# EAGLE board rev0.1 parts placement (EAGLE 8.6.0)
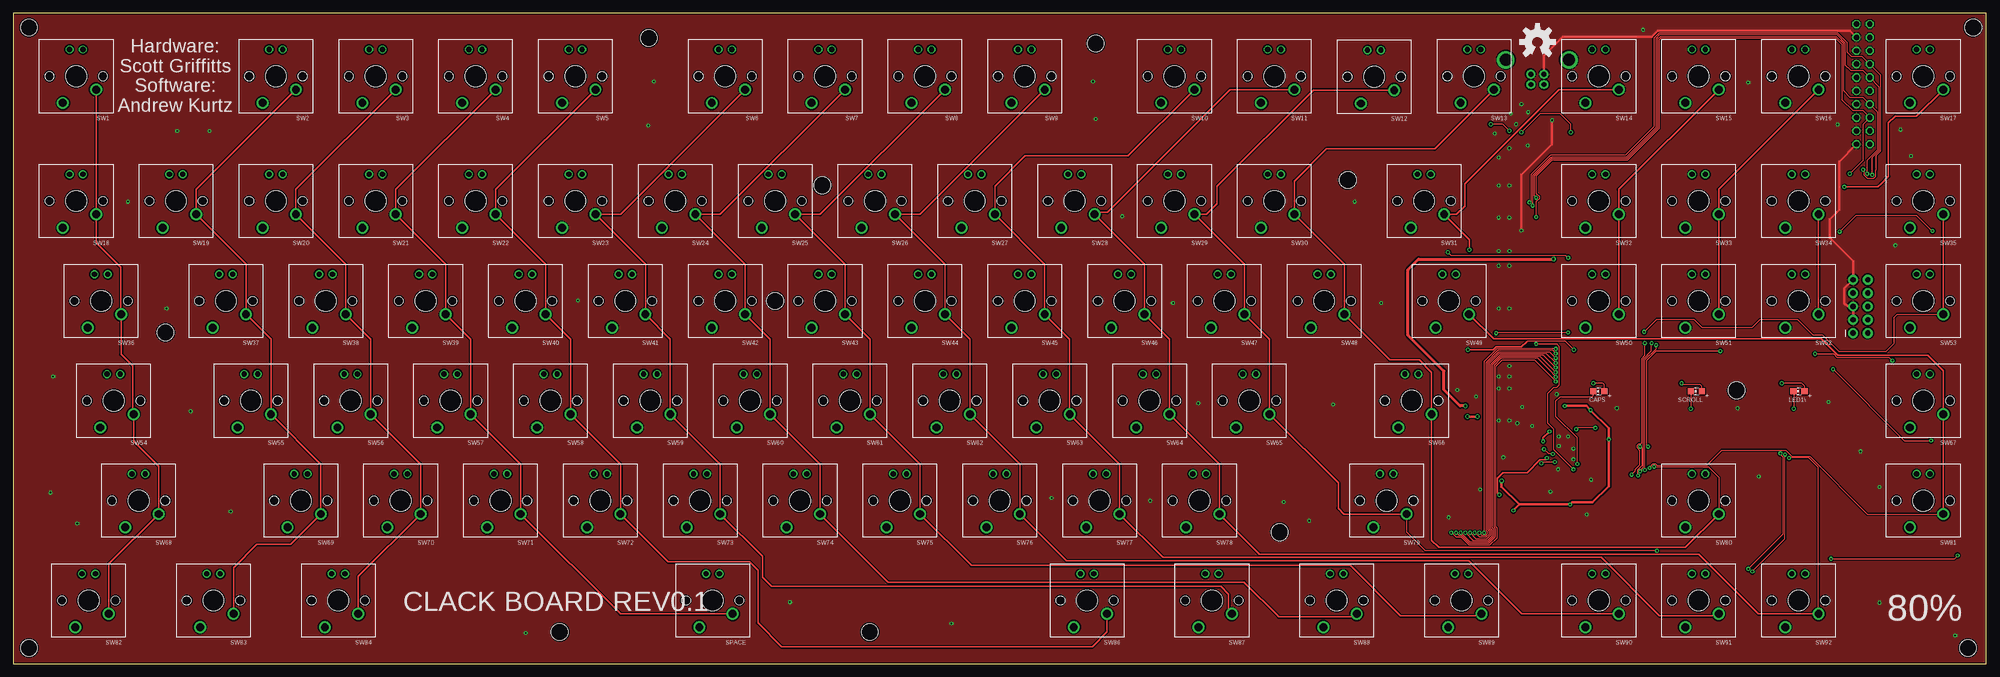
[diagram p6: board, top side]
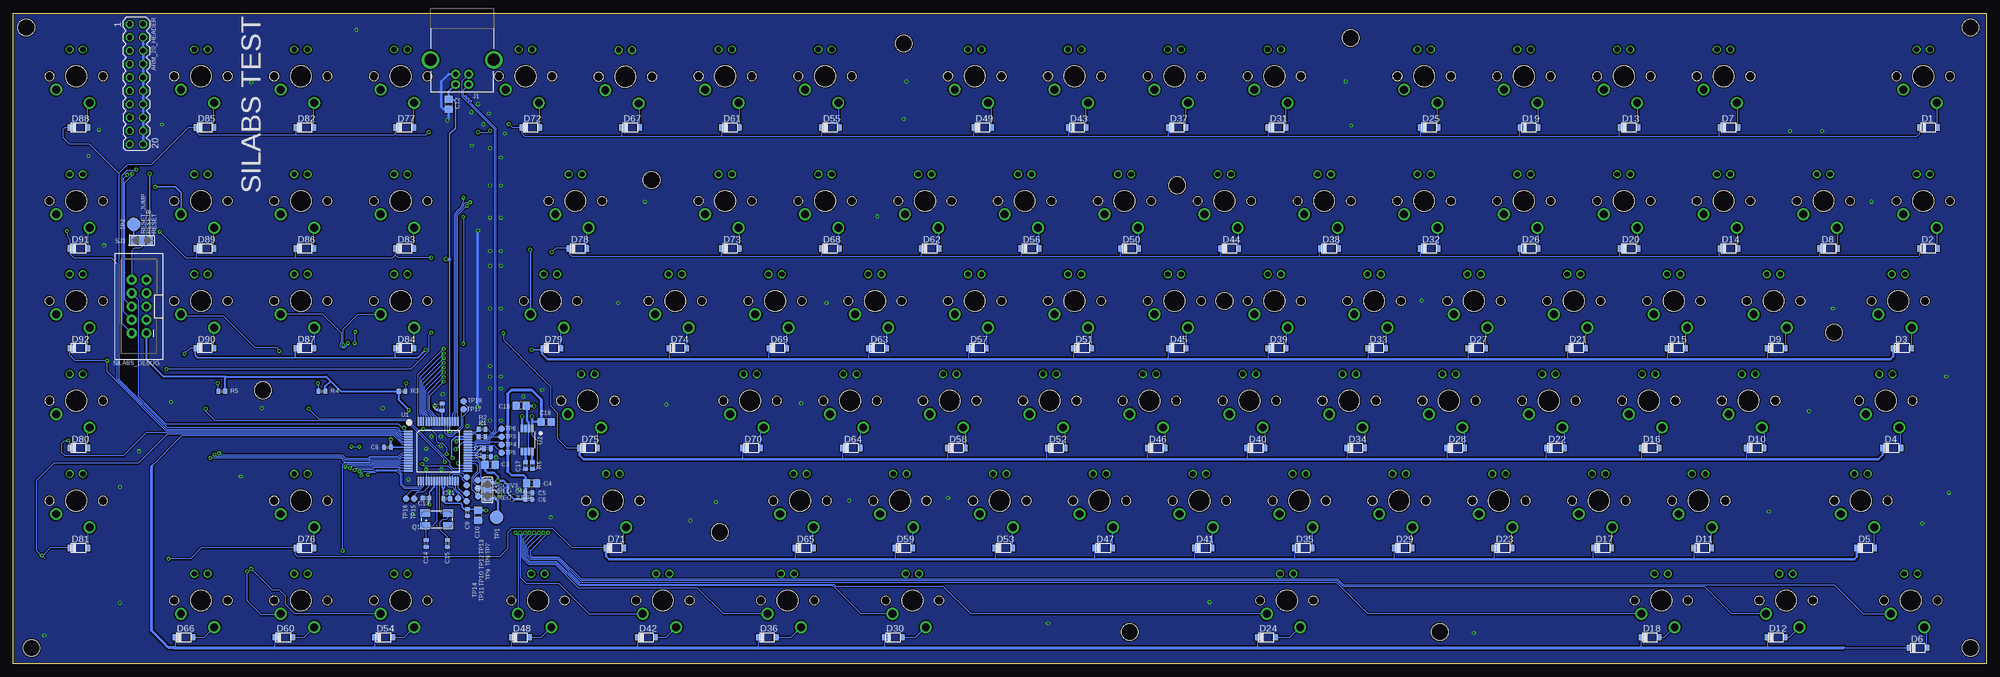
[diagram p7: board, bottom side, seen from below]

Size 375.5 x 123.75 mm. Coordinates in mm from the lower left corner, seen from the top.
Outline: 0,0 375.5,0 375.5,123.75 0,123.75 0,0
Copper layers (1*16): TOP 0.035mm / dielectric 0.33mm / BOTTOM 0.035mm
Design rules "alleybeachdrc4layer *": minimum track width 6mil, minimum drill 0.3mm, track to track 6mil, track to pad 6mil, pad to pad 6mil, via to via 6mil, smd to smd 6mil, copper to edge 10mil, drill to drill 0.3mm, minimum pad ring 10mil, minimum via ring 8mil, stop-mask expansion 5mil, vias tented up to drill 0.4mm, thermal gap 10mil
Holes 3.2 mm at 3,121 373,121 372,3 3,3 145,69 328,52 241,25 206,118 121,119 254,92 29,63 154,91 163,6 104,6

## Footprints (pad centres in the part's own frame; a part is rotated, then mirrored left to right if it is on the bottom)
MA10-2 = drill 1.016 octagon: 1 -11.43,-1.27; 2 -11.43,1.27; 3 -8.89,-1.27; 4 -8.89,1.27; 5 -6.35,-1.27; 6 -6.35,1.27; 7 -3.81,-1.27; 8 -3.81,1.27; 9 -1.27,-1.27; 10 -1.27,1.27; 11 1.27,-1.27; 12 1.27,1.27; 13 3.81,-1.27; 14 3.81,1.27; 15 6.35,-1.27; 16 6.35,1.27; 17 8.89,-1.27; 18 8.89,1.27; 19 11.43,-1.27; 20 11.43,1.27
C0402 = smd 0.7 x 0.9: 1 -0.65,0; 2 0.65,0
C0805 = smd 1.3 x 1.5: 1 -0.95,0; 2 0.95,0
CHIP-LED0805 = smd 1.2 x 1.2: A 0,-1.05; C 0,1.05
SOD323 = smd 0.9 x 1.2: 1 -1.7,0; 2 1.7,0
USB-B-PTH = drill 0.914 pad 1.676: D+ 0,1.25; D- 1.981,1.25; GND 0,-1.25; VBUS 1.981,-1.25 | drill 2.286: S1 -2.718,-6.02; S2 -2.718,6.02
CTS406 = smd 1.9 x 1.4: 1 -2.2,-1.2; 2 2.2,-1.2; 3 2.2,1.2; 4 -2.2,1.2
R0402 = smd 0.7 x 0.9: 1 -0.65,0; 2 0.65,0
2X5-SHROUDED_LOCK = drill 1.016 pad 1.88: 1 -1.397,5.08; 2 1.397,5.08; 3 -1.397,2.54; 4 1.397,2.54; 5 -1.397,0; 6 1.397,0; 7 -1.397,-2.54; 8 1.397,-2.54; 9 -1.397,-5.08; 10 1.397,-5.08
SJ_2 = smd 1.168 x 1.6: 1 -1.524,0; 2 0,0; 3 1.524,0
CHERRY_MX = drill 1.5: 1 -3.81,2.54; 2 2.54,5.08 | drill 1: A -1.27,-5.08; K 1.27,-5.08 | hole 4: 0,0 | hole 1.7: 5.08,0; -5.08,0
B2,54 = smd 2.54 x 2.54: TP 0,0
B1,27 = smd 1.27 x 1.27: TP 0,0
EFM32LG332F256G-E-QFP64 = smd 1.6 x 0.3: 1 -5.65,3.75; 2 -5.65,3.25; 3 -5.65,2.75; 4 -5.65,2.25; 5 -5.65,1.75; 6 -5.65,1.25; 7 -5.65,0.75; 8 -5.65,0.25; 9 -5.65,-0.25; 10 -5.65,-0.75; 11 -5.65,-1.25; 12 -5.65,-1.75; 13 -5.65,-2.25; 14 -5.65,-2.75; 15 -5.65,-3.25; 16 -5.65,-3.75; 33 5.65,-3.75; 34 5.65,-3.25; 35 5.65,-2.75; 36 5.65,-2.25; 37 5.65,-1.75; 38 5.65,-1.25; 39 5.65,-0.75; 40 5.65,-0.25; 41 5.65,0.25; 42 5.65,0.75; 43 5.65,1.25; 44 5.65,1.75; 45 5.65,2.25; 46 5.65,2.75; 47 5.65,3.25; 48 5.65,3.75 | smd 0.3 x 1.6: 17 -3.75,-5.65; 18 -3.25,-5.65; 19 -2.75,-5.65; 20 -2.25,-5.65; 21 -1.75,-5.65; 22 -1.25,-5.65; 23 -0.75,-5.65; 24 -0.25,-5.65; 25 0.25,-5.65; 26 0.75,-5.65; 27 1.25,-5.65; 28 1.75,-5.65; 29 2.25,-5.65; 30 2.75,-5.65; 31 3.25,-5.65; 32 3.75,-5.65; 49 3.75,5.65; 50 3.25,5.65; 51 2.75,5.65; 52 2.25,5.65; 53 1.75,5.65; 54 1.25,5.65; 55 0.75,5.65; 56 0.25,5.65; 57 -0.25,5.65; 58 -0.75,5.65; 59 -1.25,5.65; 60 -1.75,5.65; 61 -2.25,5.65; 62 -2.75,5.65; 63 -3.25,5.65; 64 -3.75,5.65
LP3982IMM-3.3/NOPB = smd 0.45 x 1.45: 1 -0.975,-2.2; 2 -0.325,-2.2; 3 0.325,-2.2; 4 0.975,-2.2; 5 0.975,2.2; 6 0.325,2.2; 7 -0.325,2.2; 8 -0.975,2.2

## Placement (x,y rotation side)
ARM_20_HEADER  [MA10-2]  352.04,110.24 270 bottom
C1  0.1uF  [C0402]  285.24,39.37 0 bottom
C2  10uF  [C0805]  284.73,37.85 0 bottom
C3  1uF  [C0402]  285.24,40.89 0 bottom
C4  10uF  [C0805]  276.86,34.29 0 bottom
C5  1uF  [C0402]  277.37,32.51 0 bottom
C6  0.1uF  [C0402]  277.37,31.24 0 bottom
C7  0.1uF  [C0402]  293.88,48.83 90 bottom
C8  0.1uF  [C0402]  304.29,41.15 180 bottom
C9  0.1uF  [C0402]  289.05,28.7 270 bottom
C10  10uF  [C0805]  287.02,28.19 270 bottom
C11  0.1uF  [C0402]  292.99,31.37 0 bottom
C12  4.7uF  [C0805]  292.61,106.43 270 bottom
C13  0.1uF  [C0402]  296.93,31.5 180 bottom
C14  22pF  [C0402]  296.93,22.86 270 bottom
C15  22pF  [C0402]  292.86,22.86 270 bottom
C16  4.7uF  [C0805]  278.83,49.02 180 bottom
C17  33nF  [C0402]  278,37.66 270 bottom
C18  2.2uF  [C0805]  274.07,45.97 0 bottom
CAPS  [CHIP-LED0805]  301.75,51.82 90 top
D1  1N4148  [SOD323]  11,102 0 bottom
D2  1N4148  [SOD323]  11,79 0 bottom
D3  1N4148  [SOD323]  16,60 0 bottom
D4  1N4148  [SOD323]  18,41 0 bottom
D5  1N4148  [SOD323]  23,22 0 bottom
D6  1N4148  [SOD323]  13,3 0 bottom
D7  1N4148  [SOD323]  49,102 0 bottom
D8  1N4148  [SOD323]  30,79 0 bottom
D9  1N4148  [SOD323]  40,60 0 bottom
D10  1N4148  [SOD323]  44,41 0 bottom
D11  1N4148  [SOD323]  54,22 0 bottom
D12  1N4148  [SOD323]  40,5 0 bottom
D13  1N4148  [SOD323]  68,102 0 bottom
D14  1N4148  [SOD323]  49,79 0 bottom
D15  1N4148  [SOD323]  59,60 0 bottom
D16  1N4148  [SOD323]  64,41 0 bottom
D17  1N4148  [SOD323]  73,22 0 bottom
D18  1N4148  [SOD323]  64,5 0 bottom
D19  1N4148  [SOD323]  87,102 0 bottom
D20  1N4148  [SOD323]  68,79 0 bottom
D21  1N4148  [SOD323]  78,60 0 bottom
D22  1N4148  [SOD323]  82,41 0 bottom
D23  1N4148  [SOD323]  92,22 0 bottom
D24  1N4148  [SOD323]  137,5 0 bottom
D25  1N4148  [SOD323]  106,102 0 bottom
D26  1N4148  [SOD323]  87,79 0 bottom
D27  1N4148  [SOD323]  97,60 0 bottom
D28  1N4148  [SOD323]  101,41 0 bottom
D29  1N4148  [SOD323]  111,22 0 bottom
D30  1N4148  [SOD323]  208,5 0 bottom
D31  1N4148  [SOD323]  135,102 0 bottom
D32  1N4148  [SOD323]  106,79 0 bottom
D33  1N4148  [SOD323]  116,60 0 bottom
D34  1N4148  [SOD323]  120,41 0 bottom
D35  1N4148  [SOD323]  130,22 0 bottom
D36  1N4148  [SOD323]  232,5 0 bottom
D37  1N4148  [SOD323]  154,102 0 bottom
D38  1N4148  [SOD323]  125,79 0 bottom
D39  1N4148  [SOD323]  135,60 0 bottom
D40  1N4148  [SOD323]  139,41 0 bottom
D41  1N4148  [SOD323]  149,22 0 bottom
D42  1N4148  [SOD323]  255,5 0 bottom
D43  1N4148  [SOD323]  173,102 0 bottom
D44  1N4148  [SOD323]  144,79 0 bottom
D45  1N4148  [SOD323]  154,60 0 bottom
D46  1N4148  [SOD323]  158,41 0 bottom
D47  1N4148  [SOD323]  168,22 0 bottom
D48  1N4148  [SOD323]  279,5 0 bottom
D49  1N4148  [SOD323]  191,102 0 bottom
D50  1N4148  [SOD323]  163,79 0 bottom
D51  1N4148  [SOD323]  172,60 0 bottom
D52  1N4148  [SOD323]  177,41 0 bottom
D53  1N4148  [SOD323]  187,22 0 bottom
D54  1N4148  [SOD323]  305,5 0 bottom
D55  1N4148  [SOD323]  220,102 0 bottom
D56  1N4148  [SOD323]  182,79 0 bottom
D57  1N4148  [SOD323]  192,60 0 bottom
D58  1N4148  [SOD323]  196,41 0 bottom
D59  1N4148  [SOD323]  206,22 0 bottom
D60  1N4148  [SOD323]  324,5 0 bottom
D61  1N4148  [SOD323]  239,102 0 bottom
D62  1N4148  [SOD323]  201,79 0 bottom
D63  1N4148  [SOD323]  211,60 0 bottom
D64  1N4148  [SOD323]  216,41 0 bottom
D65  1N4148  [SOD323]  225,22 0 bottom
D66  1N4148  [SOD323]  343,5 0 bottom
D67  1N4148  [SOD323]  258,102 0 bottom
D68  1N4148  [SOD323]  220,79 0 bottom
D69  1N4148  [SOD323]  230,60 0 bottom
D70  1N4148  [SOD323]  235,41 0 bottom
D71  1N4148  [SOD323]  261,22 0 bottom
D72  1N4148  [SOD323]  277,102 0 bottom
D73  1N4148  [SOD323]  239,79 0 bottom
D74  1N4148  [SOD323]  249,60 0 bottom
D75  1N4148  [SOD323]  266,41 0 bottom
D76  1N4148  [SOD323]  320,22 0 bottom
D77  1N4148  [SOD323]  301,102 0 bottom
D78  1N4148  [SOD323]  268,79 0 bottom
D79  1N4148  [SOD323]  273,60 0 bottom
D80  1N4148  [SOD323]  363,41 0 bottom
D81  1N4148  [SOD323]  363,22 0 bottom
D82  1N4148  [SOD323]  320,102 0 bottom
D83  1N4148  [SOD323]  301,79 0 bottom
D84  1N4148  [SOD323]  301,60 0 bottom
D85  1N4148  [SOD323]  339,102 0 bottom
D86  1N4148  [SOD323]  320,79 0 bottom
D87  1N4148  [SOD323]  320,60 0 bottom
D88  1N4148  [SOD323]  363,102 0 bottom
D89  1N4148  [SOD323]  339,79 0 bottom
D90  1N4148  [SOD323]  339,60 0 bottom
D91  1N4148  [SOD323]  363,79 0 bottom
D92  1N4148  [SOD323]  363,60 0 bottom
J1  USB-B  [USB-B-PTH]  290.07,112.14 270 bottom
LED1\  [CHIP-LED0805]  339.85,51.82 90 top
Q1  48MHz  [CTS406]  294.89,27.43 0 bottom
R1  15R  [R0402]  286.26,43.18 0 bottom
R2  15R  [R0402]  286.26,44.58 0 bottom
R3  100R  [R0402]  301.5,51.82 0 bottom
R4  100R  [R0402]  316.74,51.82 180 bottom
R5  100R  [R0402]  335.79,51.82 180 bottom
R6  100K  [R0402]  276.67,37.66 270 bottom
SCROLL  [CHIP-LED0805]  320.29,51.82 90 top
SILABS_DEBUG  [2X5-SHROUDED_LOCK]  351.54,67.94 180 bottom
SJ1  [SJ_2]  285.24,33.02 90 bottom
SJ2  [SJ_2]  351.03,80.52 180 bottom
SPACE  CHERRY_MX  [CHERRY_MX]  133.12,12 180 top
SW1  CHERRY_MX  [CHERRY_MX]  12,111.75 180 top
SW2  CHERRY_MX  [CHERRY_MX]  50,111.75 180 top
SW3  CHERRY_MX  [CHERRY_MX]  69,111.75 180 top
SW4  CHERRY_MX  [CHERRY_MX]  88,111.75 180 top
SW5  CHERRY_MX  [CHERRY_MX]  107,111.75 180 top
SW6  CHERRY_MX  [CHERRY_MX]  135.5,111.75 180 top
SW7  CHERRY_MX  [CHERRY_MX]  154.5,111.75 180 top
SW8  CHERRY_MX  [CHERRY_MX]  173.5,111.75 180 top
SW9  CHERRY_MX  [CHERRY_MX]  192.5,111.75 180 top
SW10  CHERRY_MX  [CHERRY_MX]  221,111.75 180 top
SW11  CHERRY_MX  [CHERRY_MX]  240,111.75 180 top
SW12  CHERRY_MX  [CHERRY_MX]  259,111.65 180 top
SW13  CHERRY_MX  [CHERRY_MX]  278,111.75 180 top
SW14  CHERRY_MX  [CHERRY_MX]  301.75,111.75 180 top
SW15  CHERRY_MX  [CHERRY_MX]  320.75,111.75 180 top
SW16  CHERRY_MX  [CHERRY_MX]  339.75,111.75 180 top
SW17  CHERRY_MX  [CHERRY_MX]  363.5,111.75 180 top
SW18  CHERRY_MX  [CHERRY_MX]  12,88 180 top
SW19  CHERRY_MX  [CHERRY_MX]  31,88 180 top
SW20  CHERRY_MX  [CHERRY_MX]  50,88 180 top
SW21  CHERRY_MX  [CHERRY_MX]  69,88 180 top
SW22  CHERRY_MX  [CHERRY_MX]  88,88 180 top
SW23  CHERRY_MX  [CHERRY_MX]  107,88 180 top
SW24  CHERRY_MX  [CHERRY_MX]  126,88 180 top
SW25  CHERRY_MX  [CHERRY_MX]  145,88 180 top
SW26  CHERRY_MX  [CHERRY_MX]  164,88 180 top
SW27  CHERRY_MX  [CHERRY_MX]  183,88 180 top
SW28  CHERRY_MX  [CHERRY_MX]  202,88 180 top
SW29  CHERRY_MX  [CHERRY_MX]  221,88 180 top
SW30  CHERRY_MX  [CHERRY_MX]  240,88 180 top
SW31  CHERRY_MX  [CHERRY_MX]  268.5,88 180 top
SW32  CHERRY_MX  [CHERRY_MX]  301.75,88 180 top
SW33  CHERRY_MX  [CHERRY_MX]  320.75,88 180 top
SW34  CHERRY_MX  [CHERRY_MX]  339.75,88 180 top
SW35  CHERRY_MX  [CHERRY_MX]  363.5,88 180 top
SW36  CHERRY_MX  [CHERRY_MX]  16.75,69 180 top
SW37  CHERRY_MX  [CHERRY_MX]  40.5,69 180 top
SW38  CHERRY_MX  [CHERRY_MX]  59.5,69 180 top
SW39  CHERRY_MX  [CHERRY_MX]  78.5,69 180 top
SW40  CHERRY_MX  [CHERRY_MX]  97.5,69 180 top
SW41  CHERRY_MX  [CHERRY_MX]  116.5,69 180 top
SW42  CHERRY_MX  [CHERRY_MX]  135.5,69 180 top
SW43  CHERRY_MX  [CHERRY_MX]  154.5,69 180 top
SW44  CHERRY_MX  [CHERRY_MX]  173.5,69 180 top
SW45  CHERRY_MX  [CHERRY_MX]  192.5,69 180 top
SW46  CHERRY_MX  [CHERRY_MX]  211.5,69 180 top
SW47  CHERRY_MX  [CHERRY_MX]  230.5,69 180 top
SW48  CHERRY_MX  [CHERRY_MX]  249.5,69 180 top
SW49  CHERRY_MX  [CHERRY_MX]  273.25,69 180 top
SW50  CHERRY_MX  [CHERRY_MX]  301.75,69 180 top
SW51  CHERRY_MX  [CHERRY_MX]  320.75,69 180 top
SW52  CHERRY_MX  [CHERRY_MX]  339.75,69 180 top
SW53  CHERRY_MX  [CHERRY_MX]  363.5,69 180 top
SW54  CHERRY_MX  [CHERRY_MX]  19.12,50 180 top
SW55  CHERRY_MX  [CHERRY_MX]  45.25,50 180 top
SW56  CHERRY_MX  [CHERRY_MX]  64.25,50 180 top
SW57  CHERRY_MX  [CHERRY_MX]  83.25,50 180 top
SW58  CHERRY_MX  [CHERRY_MX]  102.25,50 180 top
SW59  CHERRY_MX  [CHERRY_MX]  121.25,50 180 top
SW60  CHERRY_MX  [CHERRY_MX]  140.25,50 180 top
SW61  CHERRY_MX  [CHERRY_MX]  159.25,50 180 top
SW62  CHERRY_MX  [CHERRY_MX]  178.25,50 180 top
SW63  CHERRY_MX  [CHERRY_MX]  197.25,50 180 top
SW64  CHERRY_MX  [CHERRY_MX]  216.25,50 180 top
SW65  CHERRY_MX  [CHERRY_MX]  235.25,50 180 top
SW66  CHERRY_MX  [CHERRY_MX]  266.12,50 180 top
SW67  CHERRY_MX  [CHERRY_MX]  363.5,50 180 top
SW68  CHERRY_MX  [CHERRY_MX]  23.88,31 180 top
SW69  CHERRY_MX  [CHERRY_MX]  54.75,31 180 top
SW70  CHERRY_MX  [CHERRY_MX]  73.75,31 180 top
SW71  CHERRY_MX  [CHERRY_MX]  92.75,31 180 top
SW72  CHERRY_MX  [CHERRY_MX]  111.75,31 180 top
SW73  CHERRY_MX  [CHERRY_MX]  130.75,31 180 top
SW74  CHERRY_MX  [CHERRY_MX]  149.75,31 180 top
SW75  CHERRY_MX  [CHERRY_MX]  168.75,31 180 top
SW76  CHERRY_MX  [CHERRY_MX]  187.75,31 180 top
SW77  CHERRY_MX  [CHERRY_MX]  206.75,31 180 top
SW78  CHERRY_MX  [CHERRY_MX]  225.75,31 180 top
SW79  CHERRY_MX  [CHERRY_MX]  261.38,31 180 top
SW80  CHERRY_MX  [CHERRY_MX]  320.75,31 180 top
SW81  CHERRY_MX  [CHERRY_MX]  363.5,31 180 top
SW82  CHERRY_MX  [CHERRY_MX]  14.38,12 180 top
SW83  CHERRY_MX  [CHERRY_MX]  38.12,12 180 top
SW84  CHERRY_MX  [CHERRY_MX]  61.88,12 180 top
SW86  CHERRY_MX  [CHERRY_MX]  204.38,12 180 top
SW87  CHERRY_MX  [CHERRY_MX]  228.12,12 180 top
SW88  CHERRY_MX  [CHERRY_MX]  251.88,12 180 top
SW89  CHERRY_MX  [CHERRY_MX]  275.62,12 180 top
SW90  CHERRY_MX  [CHERRY_MX]  301.75,12 180 top
SW91  CHERRY_MX  [CHERRY_MX]  320.75,12 180 top
SW92  CHERRY_MX  [CHERRY_MX]  339.75,12 180 top
TP1  PTR1B2,54  [B2,54]  283.53,27.81 90 bottom
TP2  PTR1B2,54  [B2,54]  352.55,83.57 90 bottom
TP3  PTR1B1,27  [B1,27]  282.57,43.18 270 bottom
TP4  PTR1B1,27  [B1,27]  282.57,41.66 270 bottom
TP5  PTR1B1,27  [B1,27]  282.57,40.13 270 bottom
TP6  PTR1B1,27  [B1,27]  282.57,44.7 270 bottom
TP7  PTR1B1,27  [B1,27]  287.13,34.88 270 bottom
TP8  PTR1B1,27  [B1,27]  287.15,33.4 270 bottom
TP9  PTR1B1,27  [B1,27]  287.02,31.88 270 bottom
TP10  PTR1B1,27  [B1,27]  289.18,32.38 270 bottom
TP11  PTR1B1,27  [B1,27]  289.18,30.86 270 bottom
TP12  PTR1B1,27  [B1,27]  289.18,33.91 270 bottom
TP13  PTR1B1,27  [B1,27]  289.18,35.43 270 bottom
TP14  PTR1B1,27  [B1,27]  290.83,31.5 270 bottom
TP15  PTR1B1,27  [B1,27]  299.21,31.37 270 bottom
TP16  PTR1B1,27  [B1,27]  300.74,31.37 270 bottom
TP17  PTR1B1,27  [B1,27]  289.81,48.39 270 bottom
TP18  PTR1B1,27  [B1,27]  289.81,49.91 270 bottom
U1  EFM32LG332F256G-E-QFP64  [EFM32LG332F256G-E-QFP64]  294.64,40.39 0 bottom
U2  LP3982IMM-3.3/NOPB  [LP3982IMM-3.3/NOPB]  277.69,42.55 180 bottom
U$15  [OSHW-LOGO-L]  290.07,118.24 0 top

## Tracks (layer width: path | path; a pad name or v marks a point on that pad's centre or on a via)
1_N
  BOTTOM 0.152: U1.47 288.06,43.64 287.97,43.73 287.45,43.73 R1.1
1_P
  BOTTOM 0.152: U1.48 288.08,44.14 287.97,44.03 287.45,44.03 R2.1
C1  (via drill 0.3)
  TOP 0.152: v293.56,53.66 293.56,53.72 289.54,57.75 283.27,57.75 282.04,56.52 282.04,26.17 282.32,25.89 282.32,23.89 280.91,22.48 277.08,22.48 275.55,24 274.64,24 273.75,24.89 v273.69,24.89
  TOP 0.254: SW1.1 SW18.1 15.81,80.08 20.51,75.37 20.51,66.51 SW36.1 20.56,58.81 22.73,56.64 22.73,47.66 SW54.1 22.93,42.34 27.68,37.59 SW68.1 18.18,18.96 SW82.1
  BOTTOM 0.152: SW82.1 18.25,9.4 23.37,9.4 28.88,14.91 122.25,14.91 123.37,16.03 267.36,16.03 271.66,20.32 276.73,20.32 277.17,20.75 277.17,21.41 v273.69,24.89 | U1.57 294.89,46.91 296.26,48.27 296.26,50.96 v293.56,53.66
C2  (via drill 0.3)
  TOP 0.152: v293.56,54.55 293.56,54.61 293.02,55.15 292.98,55.2 290.12,58.05 283.14,58.05 281.74,56.65 281.74,26.04 282.01,25.76 282.01,24.02 280.78,22.79 277.2,22.79 275.68,24.31 275.22,24.31 274.64,24.89 v274.57,24.89
  TOP 0.254: SW83.1 41.94,18.25 46.35,22.67 52.77,22.67 SW69.1 58.56,37.96 SW55.1 49.06,61.71 SW37.1 44.31,75.96 SW19.1 34.81,90.21 SW2.1
  BOTTOM 0.152: SW83.1 48.45,9.46 53.59,14.61 122.38,14.61 123.5,15.72 267.49,15.72 271.74,19.98 271.78,20.02 276.86,20.02 277.47,20.63 277.47,22 v274.57,24.89 | U1.58 295.39,46.98 296.56,48.15 296.56,51.55 v293.56,54.55
C3  (via drill 0.3)
  TOP 0.152: v293.56,55.44 290.64,58.36 283.02,58.36 281.43,56.77 281.43,25.91 281.71,25.64 281.71,24.15 280.65,23.09 277.33,23.09 275.53,24.89 v275.46,24.89
  TOP 0.254: SW3.1 53.81,90.21 SW20.1 63.31,75.96 SW38.1 68.06,61.71 SW56.1 77.56,37.96 SW70.1 65.69,16.59 SW84.1
  BOTTOM 0.152: SW84.1 117.66,9.46 123.62,15.42 267.62,15.42 271.91,19.71 276.99,19.71 277.77,20.5 277.77,22.58 v275.46,24.89 | U1.59 295.89,46.92 296.87,47.89 296.87,52.13 v293.56,55.44
C4  (via drill 0.3)
  TOP 0.152: v293.56,56.33 291.22,58.66 282.89,58.66 281.13,56.9 281.13,25.79 281.4,25.51 281.4,24.27 280.53,23.4 277.91,23.4 276.42,24.89 v276.35,24.89
  TOP 0.254: SW4.1 72.81,90.21 SW21.1 82.31,75.96 SW39.1 87.06,61.71 SW57.1 96.56,37.96 SW71.1 115.56,9.46 SPACE.1
  BOTTOM 0.152: SPACE.1 193.23,9.46 198.5,14.73 218.96,14.73 219.32,15.09 267.72,15.09 272.04,19.41 277.11,19.41 278.08,20.37 278.08,23.16 v276.35,24.89 | U1.60 296.39,46.98 297.17,47.77 297.17,52.71 v293.56,56.33
C5  (via drill 0.3)
  TOP 0.152: v293.56,57.21 291.81,58.97 282.76,58.97 280.82,57.02 280.82,25.66 281.1,25.39 281.1,24.4 280.4,23.7 278.5,23.7 277.31,24.89 v277.24,24.89
  TOP 0.254: SW5.1 91.81,90.21 SW22.1 101.31,75.96 SW40.1 106.06,61.71 SW58.1 115.56,37.96 SW72.1 124.65,19.37 140.14,19.37 141.73,17.78 141.73,7.75 146.24,3.24 205.36,3.24 208.19,6.06 SW86.1
  BOTTOM 0.152: v277.24,24.89 278.38,23.75 278.38,20.25 277.24,19.1 272.16,19.1 267.84,14.78 219.44,14.78 214.12,9.46 SW86.1 | U1.61 296.89,47.05 297.48,47.64 297.48,53.3 v293.56,57.21
C6  (via drill 0.3)
  TOP 0.152: v293.56,58.1 292.39,59.27 282.64,59.27 280.52,57.15 280.52,25.54 280.8,25.26 280.8,24.52 280.27,24 279.08,24 278.2,24.89 v278.13,24.89
  TOP 0.254: SW6.1 115.56,85.46 SW23.1 120.31,75.96 SW41.1 125.06,61.71 SW59.1 134.56,37.96 SW73.1 142.62,20.4 142.62,16.38 144.34,14.67 229.81,14.67 231.27,13.21 231.27,10.13 SW87.1
  BOTTOM 0.152: SW87.1 240.35,9.46 245.36,14.48 267.97,14.48 272.29,18.8 277.36,18.8 278.69,20.12 278.69,24.28 278.71,24.31 v278.13,24.89 | U1.62 297.39,47.12 297.78,47.51 297.78,53.88 v293.56,58.1
C7  (via drill 0.3)
  TOP 0.152: v293.56,58.99 292.98,59.58 282.51,59.58 280.21,57.28 280.21,25.41 280.49,25.13 280.49,24.65 280.15,24.31 279.6,24.31 v279.02,24.89
  TOP 0.254: SW7.1 134.56,85.46 SW24.1 139.31,75.96 SW42.1 144.06,61.71 SW60.1 153.56,37.96 SW74.1 166.53,15.49 234.25,15.49 240.86,8.89 255.12,8.89 SW88.1
  BOTTOM 0.152: v279.02,24.89 279.02,16.38 277.88,15.24 271.65,15.24 265.87,9.46 SW88.1 | U1.63 297.89,47.19 298.08,47.39 298.08,54.47 v293.56,58.99
C8  (via drill 0.3)
  TOP 0.152: v293.56,59.88 282.38,59.88 279.91,57.4 v279.91,24.89
  TOP 0.254: SW8.1 153.56,85.46 SW25.1 158.31,75.96 SW43.1 163.06,61.71 SW61.1 172.56,37.96 SW75.1 182.35,18.67 254.44,18.67 263.97,9.14 279.12,9.14 SW89.1
  BOTTOM 0.152: U1.64 298.39,55.05 v293.56,59.88 | v279.91,24.89 279.44,24.42 SW89.1
C9  (via drill 0.3)
  TOP 0.152: v330.2,18.03 336.88,24.71 336.88,39.23 336.6,39.51 336.6,39.7 v336.3,40.01
  TOP 0.254: 289.37,9.46 287.08,9.46 276.99,19.56 200.46,19.56 SW76.1 191.56,37.96 SW62.1 182.06,61.71 SW44.1 177.31,75.96 SW26.1 172.56,85.46 SW9.1 | 289.37,9.46 | 289.37,9.46 SW90.1
  BOTTOM 0.152: U1.9 301.52,40.14 302.3,39.35 307.68,39.35 307.9,39.14 | 307.9,39.14 307.95,39.09 | SW90.1 321.88,9.46 323.6,11.18 323.6,12.83 324.74,13.97 326.14,13.97 v330.2,18.03 | v336.3,40.01 336.02,39.73 313.44,39.73 | 313.44,39.73 | 313.44,39.73 312.93,39.73 312.25,39.05 307.99,39.05 307.95,39.09 | 307.95,39.09 307.9,39.14 | 307.95,39.09
C10  (via drill 0.3)
  TOP 0.152: v330.96,17.53 337.19,23.75 v337.19,39.75
  TOP 0.254: SW10.1 212.18,96.58 192.59,96.58 186.81,90.8 SW27.1 196.31,75.96 SW45.1 201.06,61.71 SW63.1 210.56,37.96 SW77.1 218.83,20.19 302.2,20.19 313.25,9.14 324.24,9.14 SW91.1
  BOTTOM 0.152: U1.10 301.59,39.64 302.17,39.05 307.56,39.05 307.79,38.81 | 307.79,38.81 307.86,38.75 | SW91.1 324.75,9.27 328.3,9.27 330.96,11.94 v330.96,17.53 | v337.19,39.75 336.86,39.42 313.31,39.42 | 313.31,39.42 | 313.31,39.42 313.06,39.42 312.38,38.75 307.86,38.75 | 307.86,38.75 307.82,38.78 | 307.82,38.78 | 307.82,38.78 307.79,38.81
C11  (via drill 0.3)
  TOP 0.152: SW92.1 343.56,37.31 341.76,39.12 v337.95,39.12
  TOP 0.254: SW11.1 231.57,109.21 208.22,85.85 206.2,85.85 SW28.1 215.31,75.96 SW46.1 220.06,61.71 SW64.1 229.56,37.96 SW78.1 237.19,20.83 320.74,20.83 332.11,9.46 SW92.1
  BOTTOM 0.152: U1.11 301.65,39.14 302.05,38.75 307.43,38.75 307.73,38.44 312.51,38.44 313.18,39.12 v337.95,39.12
C12  (via drill 0.3)
  TOP 0.152: v312.8,21.46 268.73,21.46 265.19,25.01 SW79.1
  TOP 0.254: SW12.1 247.41,109.11 229.11,90.81 229.11,87.44 227.13,85.46 SW29.1 234.31,75.96 SW47.1 239.06,61.71 SW65.1 252.16,34.36 252.16,29.59 253.29,28.46 SW79.1
  BOTTOM 0.152: U1.12 301.72,38.64 301.92,38.44 307.3,38.44 307.62,38.12 312.52,38.12 312.93,37.72 312.93,21.59 v312.8,21.46
C13  (via drill 0.3)
  TOP 0.152: v312.29,37.47 322.58,37.47 324.56,35.48 SW80.1
  TOP 0.254: SW13.1 270.52,97.92 249.94,97.92 243.81,91.79 SW30.1 253.31,75.96 SW48.1 261.99,57.78 267.59,57.78 269.94,55.44 SW66.1 269.94,23.5 271.34,22.1 318.2,22.1 SW80.1
  BOTTOM 0.152: U1.13 307.18,38.14 307.49,37.82 311.94,37.82 v312.29,37.47
C14  (via drill 0.3, 0.43)
  TOP 0.152: v311.4,37.21 311.71,37.52 311.71,37.71 312.05,38.05 312.53,38.05 312.81,37.77 322.33,37.77 325.14,40.59 337.3,40.59 338.46,39.42 341.88,39.42 352.84,28.46 SW81.1
  TOP 0.254: SW14.1 294.19,109.21 276.23,91.25 276.23,87.06 274.63,85.46 SW31.1 277.11,80.66 v277.11,78.74 | SW49.1 281.74,61.78 344.11,61.78 347.22,58.67 364.36,58.67 367.31,55.73 SW67.1 SW81.1
  BOTTOM 0.152: U1.14 301.8,37.64 301.99,37.83 307.05,37.83 307.37,37.52 311.1,37.52 v311.4,37.21
  BOTTOM 0.254: v277.11,78.74 277.06,78.69 SW49.1
C15  (via drill 0.3)
  TOP 0.152: v310.51,36.83 310.51,57.78 312.67,59.94 v312.67,60.58
  TOP 0.254: SW15.1 305.56,90.21 SW32.1 SW50.1
  BOTTOM 0.152: U1.15 301.73,37.14 302.12,37.53 306.92,37.53 307.24,37.21 310.13,37.21 v310.51,36.83 | v312.67,60.58 312.67,63.63 309.88,66.42 305.6,66.42 SW50.1
C16  (via drill 0.3)
  TOP 0.152: v309.63,36.58 309.93,36.88 309.93,37.07 310.21,37.35 310.21,57.91 311.79,59.49 v311.79,60.96
  TOP 0.254: SW16.1 324.56,90.21 SW33.1 SW51.1
  BOTTOM 0.152: U1.16 301.66,36.64 302.24,37.22 306.8,37.22 307.11,36.91 309.3,36.91 v309.63,36.58 | v311.79,60.96 312.09,60.65 312.09,60.34 312.43,60 312.92,60 313.26,60.34 313.26,60.82 312.98,61.1 312.98,62.81 316.62,66.46 SW51.1
C17  (via drill 0.3, 0.35)
  TOP 0.152: v324.87,59.44 312.6,59.44 310.82,57.66 310.82,41.6 v311.15,41.27 | v309.63,41.27 309.9,41 309.9,37.68 309.04,36.82 309.04,36.34 309.21,36.17 v309.21,35.78
  TOP 0.254: SW34.1 SW52.1 | 355.5,91.34 355.41,91.25 | 355.5,91.34 356.87,92.71 356.87,102.87 358.14,104.14 362.2,104.14 367.27,109.21 SW17.1 | v348.49,90.68 354.84,90.68 355.5,91.34
  BOTTOM 0.152: U1.17 298.39,33.72 298.58,33.53 300.86,33.53 301.5,34.16 301.5,36.05 302.37,36.92 306.45,36.92 306.77,36.6 308.84,36.6 309.04,36.4 309.04,36.34 309.21,36.17 v309.21,35.78 | SW52.1 343.27,66.17 335.53,66.17 329.56,60.2 325.37,60.2 324.87,59.69 v324.87,59.44 | v311.15,41.27 v309.63,41.27
  BOTTOM 0.254: SW34.1 343.56,89.56 344.68,90.68 v348.49,90.68
C18  (via drill 0.3)
  TOP 0.152: v307.98,35.94 308.74,36.7 308.74,36.94 309.6,37.8 309.6,40.48 309.04,41.03 309.04,41.52 309.38,41.86 309.73,41.86 309.9,42.04 309.9,58.04 310.51,58.65 v310.51,60.96 | v310.39,63.12 312.8,65.53 319.79,65.53 321.31,64.01 330.96,64.01 332.36,65.41 339.6,65.41 342.56,62.45 344.38,62.45 347.49,59.33 356.39,59.33 357.89,60.83 357.89,65.84 358.51,66.46 SW53.1
  TOP 0.254: SW53.1 SW35.1
  BOTTOM 0.152: U1.18 297.89,33.78 298.45,33.22 300.99,33.22 301.8,34.04 301.8,35.92 302.5,36.61 306.32,36.61 306.64,36.3 307.62,36.3 v307.98,35.94 | v310.51,60.96 310.39,61.09 v310.39,63.12
GND  (via drill 0.3)
  TOP 0.508: ARM_20_HEADER.4 349.5,120.4 312.98,120.4 311.84,119.25 294.89,119.25 291.32,115.68 J1.GND | v292.86,103.38 292.86,98.81 287.02,92.96 v287.02,82.42 | ARM_20_HEADER.20 347.47,95.5 347.47,86.36 345.69,84.58 345.69,81.03 350.14,76.58 SILABS_DEBUG.9 348.49,71.37 348.49,68.58 349.12,67.94 SILABS_DEBUG.5 SILABS_DEBUG.3
  BOTTOM 0.508: ARM_20_HEADER.20 ARM_20_HEADER.18 ARM_20_HEADER.16 ARM_20_HEADER.14 ARM_20_HEADER.12 ARM_20_HEADER.10 ARM_20_HEADER.8 ARM_20_HEADER.6 ARM_20_HEADER.4 | J1.GND 292.61,112.14 294,110.74 294,105.92 293.56,105.48 C12.2 292.61,103.63 v292.86,103.38 | v287.02,82.42 287.15,82.3 v287.15,48.83
  other vias: 294,36.96 300.29,34.99 299.4,28.38 293.75,51.24 305.18,48.58 274.83,52.07 273.15,27.83 278.38,50.8 328.18,48.58 332.18,35.58 355.18,33.58 355.18,11.58 358.18,79.58 361.18,96.58 359.18,101.58 347.18,102.58 330.18,110.58 310.18,120.58 288.18,98.58 281.94,100.84 287.02,106.43 288.29,104.9 286,102.62 284.99,104.65 284.73,98.04 282.7,96.27 282.7,90.93 284.73,90.93 282.7,84.84 284.73,84.84 282.7,78.49 284.73,78.49 284.73,75.69 282.7,75.69 282.7,67.56 284.73,67.56 284.73,56.64 284.73,54.61 284.73,52.32 284.73,46.23 282.7,46.23 282.7,52.32 282.7,54.61 289.05,45.21 286.26,45.72 296.93,38.86 296.93,40.89 295.91,43.18 294.13,43.18 294.13,41.4 251.21,49.28 260.35,68.58 255.27,87.88 211.07,85.09 220.73,68.58 225.55,49.53 241.81,30.73 216.41,30.99 197.61,31.5 178.56,7.62 147.83,11.68 97.54,5.84 41.4,28.96 33.78,48.01 29.21,67.56 21.84,87.88 31.24,101.35 121.92,110.74 205.49,110.74 345.44,49.78 351.54,40.39 369.57,5.33 246.63,27.18 120.9,102.36 205.99,103.63 37.34,101.35 7.62,54.61 7.11,32.51 12.19,26.67 107.44,69.09 283.59,39.24 279.15,33.15 292.54,32.7
  pour BOTTOM (isolate 0.254): 0,0 376,0 376,124 0,124
  pour TOP (isolate 0.254): 0,0 376,0 376,124 0,124
N$1
  BOTTOM 0.508: SJ1.1 283.85,31.5 283.21,30.86 283.21,28.13 TP1.TP
N$2
  BOTTOM 0.254: U1.40 287.27,40.14 286.51,40.89 C3.1
N$3
  BOTTOM 0.152: U1.25 294.39,29.02 294,28.64 Q1.3 | Q1.3 | C15.1 292.86,24.07 294.19,25.4 294.19,26.99 293.75,27.43 292.99,27.43 292.7,27.72 Q1.3
N$4
  BOTTOM 0.152: U1.24 294.89,27.05 295.71,26.23 Q1.1 296.93,26.06 C14.1
N$5
  BOTTOM 0.254: SJ2.3 TP2.TP
N$6
  BOTTOM 0.152: D88.2 361.3,106.33 SW17.2
N$7
  BOTTOM 0.152: D6.2 11.3,6.38 SW82.2
N$8
  BOTTOM 0.152: D5.2 21.3,25.89 SW68.2
N$9
  BOTTOM 0.152: D4.2 16.3,44.63 SW54.2
N$10
  BOTTOM 0.152: SW36.2 14.3,63.83 D3.2
N$11
  BOTTOM 0.152: D2.2 9.3,82.76 SW18.2
N$12
  BOTTOM 0.152: D1.2 9.3,106.51 SW1.2
N$13
  BOTTOM 0.152: SW35.2 361.3,82.58 D91.2
N$14
  BOTTOM 0.152: D7.2 47.3,106.51 SW2.2
N$15
  BOTTOM 0.152: D12.2 37.51,5 SW83.2
N$16
  BOTTOM 0.152: D11.2 52.3,25.83 SW69.2
N$17
  BOTTOM 0.152: SW55.2 42.3,44.51 D10.2
N$18
  BOTTOM 0.152: SW37.2 38.3,63.58 D9.2
N$19
  BOTTOM 0.152: D8.2 28.3,82.76 SW19.2
N$20
  BOTTOM 0.152: D92.2 361.3,63.58 SW53.2
N$21
  BOTTOM 0.152: D90.2 337.3,63.83 SW52.2
N$22
  BOTTOM 0.152: D89.2 337.3,82.83 SW34.2
N$23
  BOTTOM 0.152: D85.2 337.3,106.58 SW16.2
N$24  (via drill 0.35)
  TOP 0.152: CAPS.A 302.8,53.05 302.51,53.34 v300.74,53.34
  BOTTOM 0.152: v300.74,53.34 300.85,53.23 R3.2
N$25  (via drill 0.35)
  TOP 0.152: SCROLL.A 321.34,52.8 321.06,53.09 317.75,53.09 v317.5,53.34
  BOTTOM 0.152: v317.5,53.34 317.5,51.93 R4.2
N$26  (via drill 0.35)
  TOP 0.152: LED1\.A 340.9,52.8 340.36,53.34 v336.55,53.34
  BOTTOM 0.152: v336.55,53.34 336.55,51.93 R5.2
N$27  (via drill 0.35)
  TOP 0.152: CAPS.C 300.7,51.02 300.48,50.8 294.39,50.8 293.62,50.04 293.62,46.99 297.69,42.93 v297.69,37.97
  BOTTOM 0.152: U1.33 291.76,36.64 292.72,37.59 297.31,37.59 v297.69,37.97
N$28  (via drill 0.35)
  TOP 0.152: SCROLL.C 319.24,48.55 v319.28,48.51
  BOTTOM 0.152: 301.58,46.48 317.25,46.48 v319.28,48.51 | 301.58,46.48 300.56,46.48 292.46,38.38 292.46,37.76 291.83,37.14 U1.34 | 301.58,46.48
N$29  (via drill 0.35)
  TOP 0.152: v293.37,38.35 291.08,38.35 v290.83,38.1 | LED1\.C 338.84,51.78 v338.84,48.51
  BOTTOM 0.152: U1.35 290.37,37.64 v290.83,38.1 | v293.37,38.35 293.46,38.44 293.46,38.95 293.79,39.28 300.69,46.18 337.01,46.18 338.84,48.01 v338.84,48.51
N$30
  BOTTOM 0.152: U1.19 297.39,33.83 298.3,32.92 299.72,32.92 300.74,31.9 TP16.TP
N$31
  BOTTOM 0.432: U2.6 C17.1
N$32
  BOTTOM 0.432: U2.8 276.71,38.35 R6.1
N$33
  BOTTOM 0.152: U1.21 296.39,33.68 297.46,32.61 298.58,32.61 299.21,31.98 TP15.TP
N$34
  BOTTOM 0.152: U1.28 292.89,33.81 292.74,33.66 291.97,33.66 291.69,33.38 291.69,33.15 290.83,32.29 TP14.TP
N$35
  BOTTOM 0.152: U1.29 292.39,36.03 292.09,36.33 290.08,36.33 TP13.TP
N$36
  BOTTOM 0.152: D14.2 47.3,82.76 SW20.2
N$37
  BOTTOM 0.152: D13.2 66.3,106.51 SW3.2
N$38
  BOTTOM 0.152: SW38.2 57.3,63.58 D15.2
N$39
  BOTTOM 0.152: SW39.2 76.3,63.58 D21.2
N$40
  BOTTOM 0.152: D20.2 66.3,82.76 SW21.2
N$41
  BOTTOM 0.152: SW57.2 80.3,44.51 D22.2
N$42
  BOTTOM 0.152: SW56.2 62.3,44.33 D16.2
N$43
  BOTTOM 0.152: D17.2 71.3,25.83 SW70.2
N$44
  BOTTOM 0.152: D23.2 90.3,25.83 SW71.2
N$45
  BOTTOM 0.152: D24.2 132.5,5 SPACE.2
N$46
  BOTTOM 0.152: D18.2 61.26,5 SW84.2
N$47
  BOTTOM 0.152: D19.2 85.3,106.51 SW4.2
N$48
  BOTTOM 0.152: D25.2 104.46,102.16 SW5.2
N$49
  BOTTOM 0.152: D31.2 133.3,106.33 SW6.2
N$50
  BOTTOM 0.152: D26.2 85.3,82.76 SW22.2
N$51
  BOTTOM 0.152: D32.2 104.3,82.76 SW23.2
N$52
  BOTTOM 0.152: SW41.2 114.3,63.58 D33.2
N$53
  BOTTOM 0.152: SW40.2 95.3,63.58 D27.2
N$54
  BOTTOM 0.152: SW58.2 99.3,44.51 D28.2
N$55
  BOTTOM 0.152: SW59.2 118.3,44.51 D34.2
N$56
  BOTTOM 0.152: D35.2 128.21,22.09 SW73.2
N$57
  BOTTOM 0.152: D29.2 109.3,25.83 SW72.2
N$58
  BOTTOM 0.152: D30.2 203.75,5 SW86.2
N$59
  BOTTOM 0.152: D36.2 227.5,5 SW87.2
N$60
  BOTTOM 0.152: D86.2 318.3,82.83 SW33.2
N$61
  BOTTOM 0.152: SW51.2 318.21,60.09 D87.2
N$62
  BOTTOM 0.152: SW50.2 299.3,63.83 D84.2
N$63
  BOTTOM 0.152: D83.2 299.3,82.83 SW32.2
N$64
  BOTTOM 0.152: D82.2 318.3,106.46 318.15,106.61
  BOTTOM 0.254: 318.15,106.61 SW15.2
N$65
  BOTTOM 0.152: D77.2 299.3,106.58 SW14.2
N$66
  BOTTOM 0.152: D78.2 266.3,82.58 SW31.2
N$67
  BOTTOM 0.152: SW49.2 271.3,63.33 D79.2
N$68
  BOTTOM 0.152: D80.2 361.3,44.58 SW67.2
N$69
  BOTTOM 0.152: SW81.2 361.3,25.58 D81.2
N$70
  BOTTOM 0.152: 318.15,25.86 SW80.2 318.21,22.09 D76.2
N$71
  BOTTOM 0.152: D75.2 264.3,44.2 SW66.2
N$72
  BOTTOM 0.152: D70.2 233.3,44.33 SW65.2
N$73
  BOTTOM 0.152: D71.2 259.3,25.45 SW79.2
N$74
  BOTTOM 0.152: SW47.2 228.3,63.58 D69.2
N$75
  BOTTOM 0.152: SW48.2 247.3,63.58 D74.2
N$76
  BOTTOM 0.152: D73.2 237.3,82.76 SW30.2
N$77
  BOTTOM 0.152: D68.2 218.3,82.76 SW29.2
N$78
  BOTTOM 0.152: D67.2 256.3,106.41 SW12.2
N$79
  BOTTOM 0.152: D72.2 275.3,106.51 SW13.2
N$80
  BOTTOM 0.152: D61.2 237.3,106.51 SW11.2
N$81
  BOTTOM 0.152: D55.2 218.3,106.51 SW10.2
N$82
  BOTTOM 0.152: D56.2 180.3,82.76 SW27.2
N$83
  BOTTOM 0.152: D62.2 199.3,82.76 SW28.2
N$84
  BOTTOM 0.152: SW46.2 209.3,63.58 D63.2
N$85
  BOTTOM 0.152: SW45.2 190.3,63.58 D57.2
N$86
  BOTTOM 0.152: SW63.2 194.3,44.51 D58.2
N$87
  BOTTOM 0.152: SW64.2 214.3,44.33 D64.2
N$88
  BOTTOM 0.152: D65.2 223.3,25.83 SW78.2
N$89
  BOTTOM 0.152: D59.2 204.3,25.83 SW77.2
N$90
  BOTTOM 0.152: D60.2 320.13,5 SW91.2
N$91
  BOTTOM 0.152: D66.2 339.13,5 SW92.2
N$92
  BOTTOM 0.152: D48.2 275,5 SW89.2
N$93
  BOTTOM 0.152: D54.2 301.13,5 SW90.2
N$94
  BOTTOM 0.152: D47.2 166.3,25.83 SW75.2
N$95
  BOTTOM 0.152: D53.2 185.3,25.83 SW76.2
N$96
  BOTTOM 0.152: SW62.2 175.3,44.51 D52.2
N$97
  BOTTOM 0.152: SW61.2 156.3,44.51 D46.2
N$98
  BOTTOM 0.152: SW43.2 152.3,63.58 D45.2
N$99
  BOTTOM 0.152: SW44.2 170.3,63.26 D51.2
N$100
  BOTTOM 0.152: D50.2 161.3,82.76 SW26.2
N$101
  BOTTOM 0.152: D44.2 142.3,82.76 SW25.2
N$102
  BOTTOM 0.152: D43.2 171.3,106.33 SW8.2
N$103
  BOTTOM 0.152: D49.2 189.3,106.01 SW9.2
N$104
  BOTTOM 0.152: D37.2 152.3,106.33 SW7.2
N$105
  BOTTOM 0.152: D38.2 123.3,82.76 SW24.2
N$106
  BOTTOM 0.152: SW42.2 133.3,63.58 D39.2
N$107
  BOTTOM 0.152: SW60.2 137.3,44.51 D40.2
N$108
  BOTTOM 0.152: D41.2 147.3,25.83 SW74.2
N$109
  BOTTOM 0.152: D42.2 251.25,5 SW88.2
N$110
  BOTTOM 0.152: U1.30 291.89,35.85 291.72,36.03 290.66,36.03 290.04,35.41 290.04,35.08 289.18,34.21 TP12.TP
N$111
  BOTTOM 0.152: TP11.TP 289.97,31.65 289.97,31.85 291.39,33.28 U1.31
N$112
  BOTTOM 0.152: U1.32 290.89,33.46 289.81,32.38 TP10.TP
N$113
  BOTTOM 0.152: U1.36 287.59,38.14 287.17,37.72 287.17,36.48 288.3,35.36 288.3,33.15 TP9.TP
N$114
  BOTTOM 0.152: U1.37 287.28,38.64 286.87,38.23 286.87,36.36 287.99,35.23 287.99,34.52 287.15,33.67 TP8.TP
N$115
  BOTTOM 0.152: U1.38 287.35,39.14 286.56,38.35 286.56,35.44 TP7.TP
N$116
  BOTTOM 0.152: U1.41 287.79,40.64 286.83,41.59 284.03,41.59 TP5.TP
N$117
  BOTTOM 0.152: U1.42 287.82,41.14 287.06,41.89 284.91,41.89 284.62,42.18 283.1,42.18 TP4.TP
N$118
  BOTTOM 0.152: U1.43 287.75,41.64 287.19,42.2 285.04,42.2 284.73,42.51 284.73,42.75 284.35,43.12 282.64,43.12 TP3.TP
N$119
  BOTTOM 0.152: U1.53 292.89,45.79 292.94,45.75 292.94,43.89 292.6,43.55 292.11,43.55 291.34,44.32 291.08,44.32 290.19,45.21 290.19,48.01 TP17.TP
N$120
  BOTTOM 0.152: U1.54 293.39,43.91 292.72,43.25 291.99,43.25 291.21,44.02 290.96,44.02 289.89,45.09 289.89,47.09 288.95,48.03 288.95,48.74 289.81,49.61 TP18.TP
R1  (via drill 0.35)
  TOP 0.152: v296.42,101.09 296.42,102.62 294.39,104.65 290.58,104.65 v287.02,101.09 | v284.73,101.35 283.46,102.62 v281.18,102.62
  BOTTOM 0.152: U1.1 301.63,44.14 302.33,44.83 346.1,44.83 355.4,54.13 355.4,93.27 | 355.4,93.27 360.93,98.81 364.74,98.81 365.94,100 365.94,101.68 365.61,102 D88.1 | 355.4,93.27 353.8,94.87 349.25,94.87 342.12,102 D85.1 340.7,101.18 340.11,100.58 321.82,100.58 | 321.82,100.58 303.02,100.58 302.77,100.84 | D77.1 302.7,100.91 302.77,100.84 | 302.77,100.84 302.51,100.58 296.93,100.58 v296.42,101.09 | v287.02,101.09 284.99,101.09 v284.73,101.35 | v281.18,102.62 280.56,102 D72.1 278.7,100.9 278.13,100.33 259.59,100.33 | 259.59,100.33 240.79,100.33 | 240.79,100.33 221.74,100.33 | 221.74,100.33 192.79,100.33 | 192.79,100.33 174.75,100.33 | 174.75,100.33 155.7,100.33 | 155.7,100.33 136.65,100.33 | 136.65,100.33 107.7,100.33 | 107.7,100.33 88.9,100.33 | 88.9,100.33 69.85,100.33 | 69.85,100.33 50.8,100.33 | 50.8,100.33 13.21,100.33 12.7,100.84 D1.1 | 50.8,100.33 50.8,101.9 D7.1 | 69.85,100.33 69.85,101.85 D13.1 | D19.1 88.9,101.8 88.9,100.33 | D25.1 107.7,100.33 | D31.1 136.7,100.38 136.65,100.33 | D37.1 155.7,100.33 | D43.1 174.7,100.38 174.75,100.33 | D49.1 192.7,100.42 192.79,100.33 | D55.1 221.7,100.37 221.74,100.33 | D61.1 240.7,100.42 240.79,100.33 | 259.59,100.33 259.59,101.89 D67.1 | D82.1 321.7,100.7 321.82,100.58
R2  (via drill 0.3, 0.35)
  TOP 0.152: v347.6,82.17 350.77,85.34 362.2,85.34 v365.25,82.3 | v273.05,78.23 273.56,77.72 295.4,77.72 v295.91,77.22
  BOTTOM 0.152: U1.2 301.56,43.64 302.45,44.53 346.23,44.53 355.7,54 355.7,76.05 356.87,77.22 363.98,77.22 364.7,77.93 D91.1 364.7,80.73 365.25,81.28 v365.25,82.3 | 340.61,77.22 342.65,77.22 v347.6,82.17 | 340.61,77.22 321.82,77.22 | 321.82,77.22 303.28,77.22 302.77,77.72 | 302.77,77.72 302.7,77.79 D83.1 | D86.1 321.82,78.88 321.82,77.22 | D89.1 340.7,77.3 340.61,77.22 | v273.05,78.23 272.28,79 D78.1 269.7,77.93 269.24,77.47 240.79,77.47 | v295.91,77.22 302.26,77.22 302.77,77.72 | 240.79,77.47 221.74,77.47 | 221.74,77.47 202.69,77.47 | 202.69,77.47 183.64,77.47 | 183.64,77.47 164.85,77.47 | 164.85,77.47 145.8,77.47 | 145.8,77.47 127,77.47 | 127,77.47 107.7,77.47 | 107.7,77.47 88.9,77.47 | 88.9,77.47 69.85,77.47 | 69.85,77.47 50.8,77.47 | 50.8,77.47 31.75,77.47 | 31.75,77.47 12.95,77.47 12.7,77.72 D2.1 | D8.1 31.75,78.95 31.75,77.47 | 50.8,77.47 50.8,78.9 D14.1 | D20.1 69.85,78.85 69.85,77.47 | D26.1 88.9,78.8 88.9,77.47 | D32.1 107.7,77.47 | D38.1 127,78.7 127,77.47 | D44.1 145.8,78.9 145.8,77.47 | D56.1 183.7,77.53 183.64,77.47 | D50.1 164.85,78.85 164.85,77.47 | D62.1 202.7,77.48 202.69,77.47 | D68.1 221.7,77.51 221.74,77.47 | D73.1 240.79,78.91 240.79,77.47
R3  (via drill 0.35)
  TOP 0.152: v342.9,58.93 346.46,58.93 347.07,58.32 356.97,58.32 v357.63,57.66 | 288.04,61.21 288.24,61.41 295.3,61.41 v297.02,59.69
  TOP 0.254: v276.86,59.69 281.69,59.69 282.24,60.24 287.06,60.24 288.04,61.21
  BOTTOM 0.152: U1.3 301.49,43.14 302.58,44.22 346.35,44.22 355.83,53.7 | 355.83,53.7 | D92.1 364.7,58.63 363.73,57.66 v357.63,57.66 357.63,55.5 355.83,53.7 | D90.1 340.87,60 341.83,60 v342.9,58.93 | D74.1 250.7,57.91 | D69.1 231.7,57.96 231.65,57.91 | D63.1 212.7,58.06 212.85,57.91 | D57.1 193.7,58.06 193.55,57.91 | D51.1 173.7,58.13 173.48,57.91 | D45.1 155.7,58.17 155.96,57.91 | D39.1 136.7,58.21 136.4,57.91 | D33.1 117.7,58.07 117.86,57.91 | D27.1 98.7,58.02 98.81,57.91 | D21.1 79.7,57.97 79.76,57.91 | D15.1 60.7,57.92 60.71,57.91 | D9.1 41.7,57.96 41.66,57.91
  BOTTOM 0.254: D79.1 275.01,59.69 v276.86,59.69 | v297.02,59.69 298.55,58.17 302.77,58.17 | 302.77,58.17 321.82,58.17 | 321.82,58.17 340.36,58.17 340.87,58.67 340.87,60 | D87.1 321.82,59.88 321.82,58.17 | D84.1 302.77,59.93 302.77,58.17
  BOTTOM 0.508: D3.1 17.7,58.5 18.29,57.91 41.66,57.91 60.71,57.91 79.76,57.91 98.81,57.91 117.86,57.91 136.4,57.91 155.96,57.91 173.48,57.91 193.55,57.91 212.85,57.91 231.65,57.91 250.7,57.91 273.81,57.91 274.83,58.93 274.83,59.87 D79.1
R4  (via drill 0.3)
  TOP 0.152: v282.19,62.87 282.32,62.99 v295.91,62.99 | v346.33,56.01 359.92,42.42 v365,42.42
  BOTTOM 0.152: U1.4 301.43,42.64 302.71,43.92 350.16,43.92 354.58,39.5 365.63,39.5 366.27,40.13 366.27,41.91 365.76,42.42 v365,42.42 364.7,42.12 D80.1 | v282.19,62.87 282.19,61.59 273.24,52.64 273.24,49.02 271.85,47.63 271.85,42.74 270.11,41 D75.1 | D70.1 236.7,39.14 236.98,38.86 | D64.1 217.7,38.88 217.68,38.86 | D58.1 197.7,39.03 197.87,38.86 | D10.1 45.7,38.88 45.72,38.86 | D16.1 65.7,38.95 65.79,38.86 | D22.1 83.82,40.88 83.82,38.86 | D28.1 102.7,38.95 102.62,38.86 | D34.1 121.7,39.08 121.92,38.86 | D40.1 140.7,38.88 140.72,38.86 | D46.1 159.7,39.05 159.51,38.86 | D52.1 178.82,40.88 178.82,38.86 | v295.91,62.99 296.42,62.48 296.42,59.44 299.85,56.01 v346.33,56.01
  BOTTOM 0.508: D4.1 19.7,39.74 20.57,38.86 45.72,38.86 65.79,38.86 83.82,38.86 102.62,38.86 121.92,38.86 140.72,38.86 159.51,38.86 178.82,38.86 197.87,38.86 217.68,38.86 236.98,38.86 266.95,38.86 267.72,39.62 267.7,39.64 D75.1
R5  (via drill 0.3)
  TOP 0.152: v345.95,19.94 369.44,19.94 v370.04,20.54
  BOTTOM 0.152: U1.5 301.36,42.14 302.83,43.61 346.15,43.61 351.66,38.1 367.79,38.1 371.09,34.8 371.09,21.59 v370.04,20.54 369.95,20.45 | 369.95,20.45 369.5,20 | 345.89,20 v345.95,19.94 341.76,19.94 339.7,22 321.82,22 | D81.1 368.4,22 369.95,20.45 | D76.1 321.82,22 | D71.1 269.14,22 272.8,25.65 280.67,25.65 281.43,24.89 281.43,21.84 282.96,20.32 321.31,20.32 321.82,20.83 321.82,22 | D11.1 55.7,19.89 55.63,19.81 | D17.1 74.93,21.77 74.93,19.81 | D23.1 93.73,21.97 93.73,19.81 | D29.1 112.78,21.92 112.78,19.81 | D35.1 131.7,19.94 131.57,19.81 | D41.1 150.7,19.99 150.88,19.81 | D47.1 169.7,19.84 169.67,19.81 | D53.1 188.7,19.83 188.72,19.81 | D59.1 207.7,19.88 207.77,19.81 | D65.1 226.7,19.93 226.82,19.81
  BOTTOM 0.508: D71.1 262.7,20.38 262.13,19.81 226.82,19.81 207.77,19.81 188.72,19.81 169.67,19.81 150.88,19.81 131.57,19.81 112.78,19.81 93.73,19.81 74.93,19.81 55.63,19.81 25.15,19.81 24.64,20.32 24.64,21.94 D5.1
R6
  BOTTOM 0.152: U1.6 301.29,41.64 302.96,43.31 343.41,43.31 349.12,37.59 | D66.1 344.7,3.28 344.93,3.05 | 27.18,3.05 14.75,3.05 D6.1 | D12.1 41.7,3.09 41.66,3.05 | D18.1 65.79,4.91 65.79,3.05 | D24.1 138.7,3.06 138.68,3.05 | D30.1 209.7,3.15 209.8,3.05 | D36.1 233.7,3.07 233.68,3.05 | D42.1 256.7,3.14 256.79,3.05 | D48.1 280.7,3.08 280.67,3.05 | D54.1 306.7,3.18 306.83,3.05 | D60.1 325.7,3.23 325.88,3.05
  BOTTOM 0.584: 346.94,4.04 349.12,6.22 349.12,37.59
  BOTTOM 0.61: 27.18,3.05 41.66,3.05 65.79,3.05 138.68,3.05 209.8,3.05 233.68,3.05 256.79,3.05 280.67,3.05 306.83,3.05 325.88,3.05 344.93,3.05 345.95,3.05 346.94,4.04
RESET  (via drill 0.3, 0.35)
  TOP 0.152: v289.81,60.83 293.75,60.83 294.26,60.33 294.26,53.09 293.75,52.58 293.24,52.58 292.1,51.44 292.1,45.72 293.24,44.58 293.24,40.64 v296.93,36.96 | v289.81,84.96 289.81,87.82 290.4,88.41 290.4,88.89 289.79,89.49 289.79,92.69 292.86,95.76 307.21,95.76 313.18,101.73 313.18,118.62 313.56,119 346.84,119 348.08,117.75 348.08,107.21 350.14,105.16 352.04,105.16 ARM_20_HEADER.15 352.04,102.62 352.04,95.76 v349.5,93.22
  BOTTOM 0.152: v289.81,84.96 v289.81,60.83 | v296.93,36.96 296.89,36.92 U1.20
  BOTTOM 0.254: SJ2.1 v349.5,93.22
RESETB
  BOTTOM 0.152: SJ2.2 351.03,79.25 351.28,78.99 352.43,78.99 352.93,78.49 SILABS_DEBUG.10
SWCLK  (via drill 0.3, 0.35)
  TOP 0.152: 292.86,96.37 | 292.86,96.37 292.61,96.37 289.18,92.94 v289.18,87.12 | 292.86,96.37 306.96,96.37 312.57,101.98 312.57,118.87 313.31,119.61 347.09,119.61 348.69,118.01 348.69,113.84 349.76,112.78 352.04,112.78 ARM_20_HEADER.9 355.14,109.68 355.14,97.66 353.82,96.34 v353.82,92.96
  BOTTOM 0.152: U1.49 290.89,85.41 v289.18,87.12 | v353.82,92.96 354.53,92.25 354.53,67 SILABS_DEBUG.4
SWDIO  (via drill 0.3, 0.35)
  TOP 0.152: 292.99,96.67 | 292.99,96.67 292.48,96.67 291.64,95.83 | 292.99,96.67 306.83,96.67 312.27,102.11 312.27,119 313.18,119.91 347.22,119.91 349,118.13 349,116.33 349.88,115.44 351.92,115.44 ARM_20_HEADER.7 355.45,111.91 355.45,97.54 354.58,96.67 354.58,93.98 354.43,93.83 354.43,92.71 354.07,92.36 352.81,92.36 352.2,92.97 352.2,93.83 v352.04,93.98 | v288.54,87.76 288.87,88.09 288.87,93.06 291.64,95.83 | 291.64,95.83
  BOTTOM 0.152: U1.50 291.39,47.57 291.19,47.77 291.19,85.54 289.76,86.97 289.76,87.36 289.37,87.76 v288.54,87.76 | v352.04,93.98 352.2,93.83 353.82,93.83 354.84,92.81 354.84,64.77 SILABS_DEBUG.2
SWO  (via drill 0.3, 0.35)
  TOP 0.152: 290.91,94.23 292.74,96.06 307.09,96.06 312.88,101.85 312.88,118.74 313.44,119.3 346.96,119.3 348.39,117.88 348.39,108.94 349.63,107.7 352.04,107.7 ARM_20_HEADER.13 354.84,104.9 354.84,97.79 352.81,95.76 v352.81,93.22 | 290.91,94.23 290.61,93.94 | v289.81,88.65 289.48,88.98 289.48,92.81 290.91,94.23 | 290.91,94.23
  BOTTOM 0.152: U1.51 291.89,47.5 291.5,47.89 291.5,85.66 290.07,87.1 290.07,87.49 289.81,87.74 v289.81,88.65 | 354.23,74.53 354.23,74.32 | 354.23,74.53 354.23,91.44 352.81,92.86 v352.81,93.22 | SILABS_DEBUG.6 354.23,69.24 354.23,74.53
TDI  (via drill 0.35)
  TOP 0.152: v301.12,44.83 297.69,44.83 v297.43,44.58 | v292.99,39.88 292.23,39.88 v291.34,40.77
  BOTTOM 0.152: TP6.TP 282.75,44.7 284.04,43.42 284.48,43.42 285.03,42.87 285.03,42.63 285.16,42.5 287.32,42.5 287.68,42.14 U1.44 289.97,42.14 v291.34,40.77 | SILABS_DEBUG.8 351.66,69.22 351.66,50.82 346.44,45.6 302.27,45.6 301.5,44.83 v301.12,44.83 | v297.43,44.58 296.04,44.58 295.02,43.56 295.02,42.42 294.59,41.98 293.89,41.98 292.99,41.08 v292.99,39.88
USB1_N
  BOTTOM 0.152: R1.2 285.15,43.18 284.61,43.73 284.16,43.73 283.57,44.32 283.57,101.79 288.4,106.63 arc90 288.4,106.84 288.34,106.91 arc-90 288.34,107.13 288.35,107.14 arc-90 288.56,107.14 288.63,107.07 arc90 288.85,107.07 288.86,107.08 arc90 288.86,107.3 288.79,107.36 arc-90 288.79,107.58 288.8,107.59 arc-90 289.01,107.59 289.08,107.52 arc90 289.3,107.52 289.31,107.53 arc90 289.31,107.75 289.24,107.81 arc-90 289.24,108.03 289.25,108.04 arc-90 289.46,108.04 289.53,107.97 arc90 289.75,107.97 289.79,108.01 289.79,109.19 J1.D-
USB1_P
  BOTTOM 0.152: R2.2 285.15,44.58 284.61,44.03 284.29,44.03 283.87,44.45 283.87,101.66 290.09,107.89 290.09,110.87 J1.D+
VBUS1  (via drill 0.3, 0.43)
  TOP 0.254: v291.15,42.29 291.15,42.93 v292.35,44.13
  TOP 0.61: v276.35,49.02 275.34,49.02 272.29,52.07 272.29,55.63 265.43,62.48 265.43,74.93 267.46,76.96 v293.12,76.96
  BOTTOM 0.152: U2.7 U2.2
  BOTTOM 0.254: U1.45 290.8,42.64 v291.15,42.29 | v292.35,44.13 292.39,44.17 U1.52 292.39,76.93 292.39,100.8 291.34,101.85 291.34,106.93 291.78,107.38 C12.1
  BOTTOM 0.432: U2.2 277.36,45.9 277.69,46.23 277.69,48.83 C16.1
  BOTTOM 0.508: J1.VBUS 292.61,108.87 C12.1
  BOTTOM 0.61: C16.1 v276.35,49.02 | v293.12,76.96 292.43,76.96 292.39,76.93
VCC3V3  (via drill 0.3, 0.35, 0.43)
  TOP 0.432: v278.64,46.99 v276.73,46.99
  TOP 0.508: 286.64,30.29 v296.29,30.29 296.67,30.67 300.55,30.67 303.66,33.78 v303.66,42.67 303.66,44.77 v300.19,48.24 299.4,49.02 v295.27,49.02 | 286.64,30.29 v285.5,29.15 | 286.64,30.29 283.24,33.69 v283.24,34.77
  BOTTOM 0.152: R6.2 275.92,37.01 275.72,37.21 275.72,42.42 276.73,43.43 276.73,44.72 U2.1
  BOTTOM 0.254: U1.39 287.22,39.64 286.96,39.37 C1.1 | U1.55 293.89,48.17 C7.1 | U1.7 303.63,41.14 C8.1 | C13.1 296.28,32.72 295.39,33.6 U1.23
  BOTTOM 0.305: C2.1 285.89,38.05 C1.1 | C10.1 287.23,29.35 C9.1 289.7,29.35 290.07,29.72 290.07,30.23 290.32,30.48 293.24,30.48 293.64,30.88 C11.1 293.64,33.29 | U1.26 293.89,33.54 293.64,33.29 | U1.27 293.39,33.54 293.64,33.29
  BOTTOM 0.406: 335.15,54.61 346.84,54.61 350.14,57.91 SILABS_DEBUG.1 | 335.15,54.61 315.98,54.61 315.1,53.73 | 315.1,53.73 313.18,51.82 R3.1 302.15,50.2 v300.19,48.24 | R4.1 316.09,52.74 315.1,53.73 | 335.15,54.61 335.14,54.6 R5.1
  BOTTOM 0.432: U2.4 278.66,46.97 v278.64,46.99 | v276.73,46.99 276.71,46.97 276.71,45.91 | U2.1 276.71,45.91 | 276.71,45.91 276.65,45.97 275.04,45.97 C18.1
  BOTTOM 0.508: v303.66,42.67 303.63,42.65 303.63,41.14 | v296.29,30.29 296.29,31.48 C13.1 | C10.1 v285.5,29.14 v285.5,29.15 | v295.27,49.02 295.27,48.64 294.8,48.17 293.89,48.17 | C2.1 285.68,36.76 285.24,36.32 283.97,36.32 283.24,35.59 v283.24,34.77 282.17,34.77 281.43,34.04 281.43,32.51 280.16,31.24 C6.1 C5.1 278.02,34.08 | 278.02,34.08 C4.1 | 281.43,36.58 280.67,35.81 278.38,35.81 278.02,35.45 278.02,34.08
  BOTTOM 0.61: SJ1.3 283.46,34.54 v283.24,34.77 | 281.43,36.58 281.43,51.31 280.67,52.07 276.86,52.07 275.04,50.25 275.04,45.97
VREG_OUT  (via drill 0.35)
  TOP 0.254: v291.85,39.12 291.49,38.76 290.56,38.76 288.12,36.32 283.46,36.32 282.45,35.31 282.45,32.51 v282.83,32.13
  BOTTOM 0.254: U1.46 291.32,43.14 292.1,42.35 292.1,39.37 v291.85,39.12 | v282.83,32.13 283.72,33.02 SJ1.2

## Text on the board
tPlace: Hardware: / Scott Griffitts | Software: / Andrew Kurtz | CLACK BOARD REV0.1 | 80%
bPlace: SILABS TEST | RESET | RESETB | RESET_JUMP | VCC3V3 | VREG_OUT | VREG_JUMP